# EAGLE design Midio (EAGLE 9.6.2)
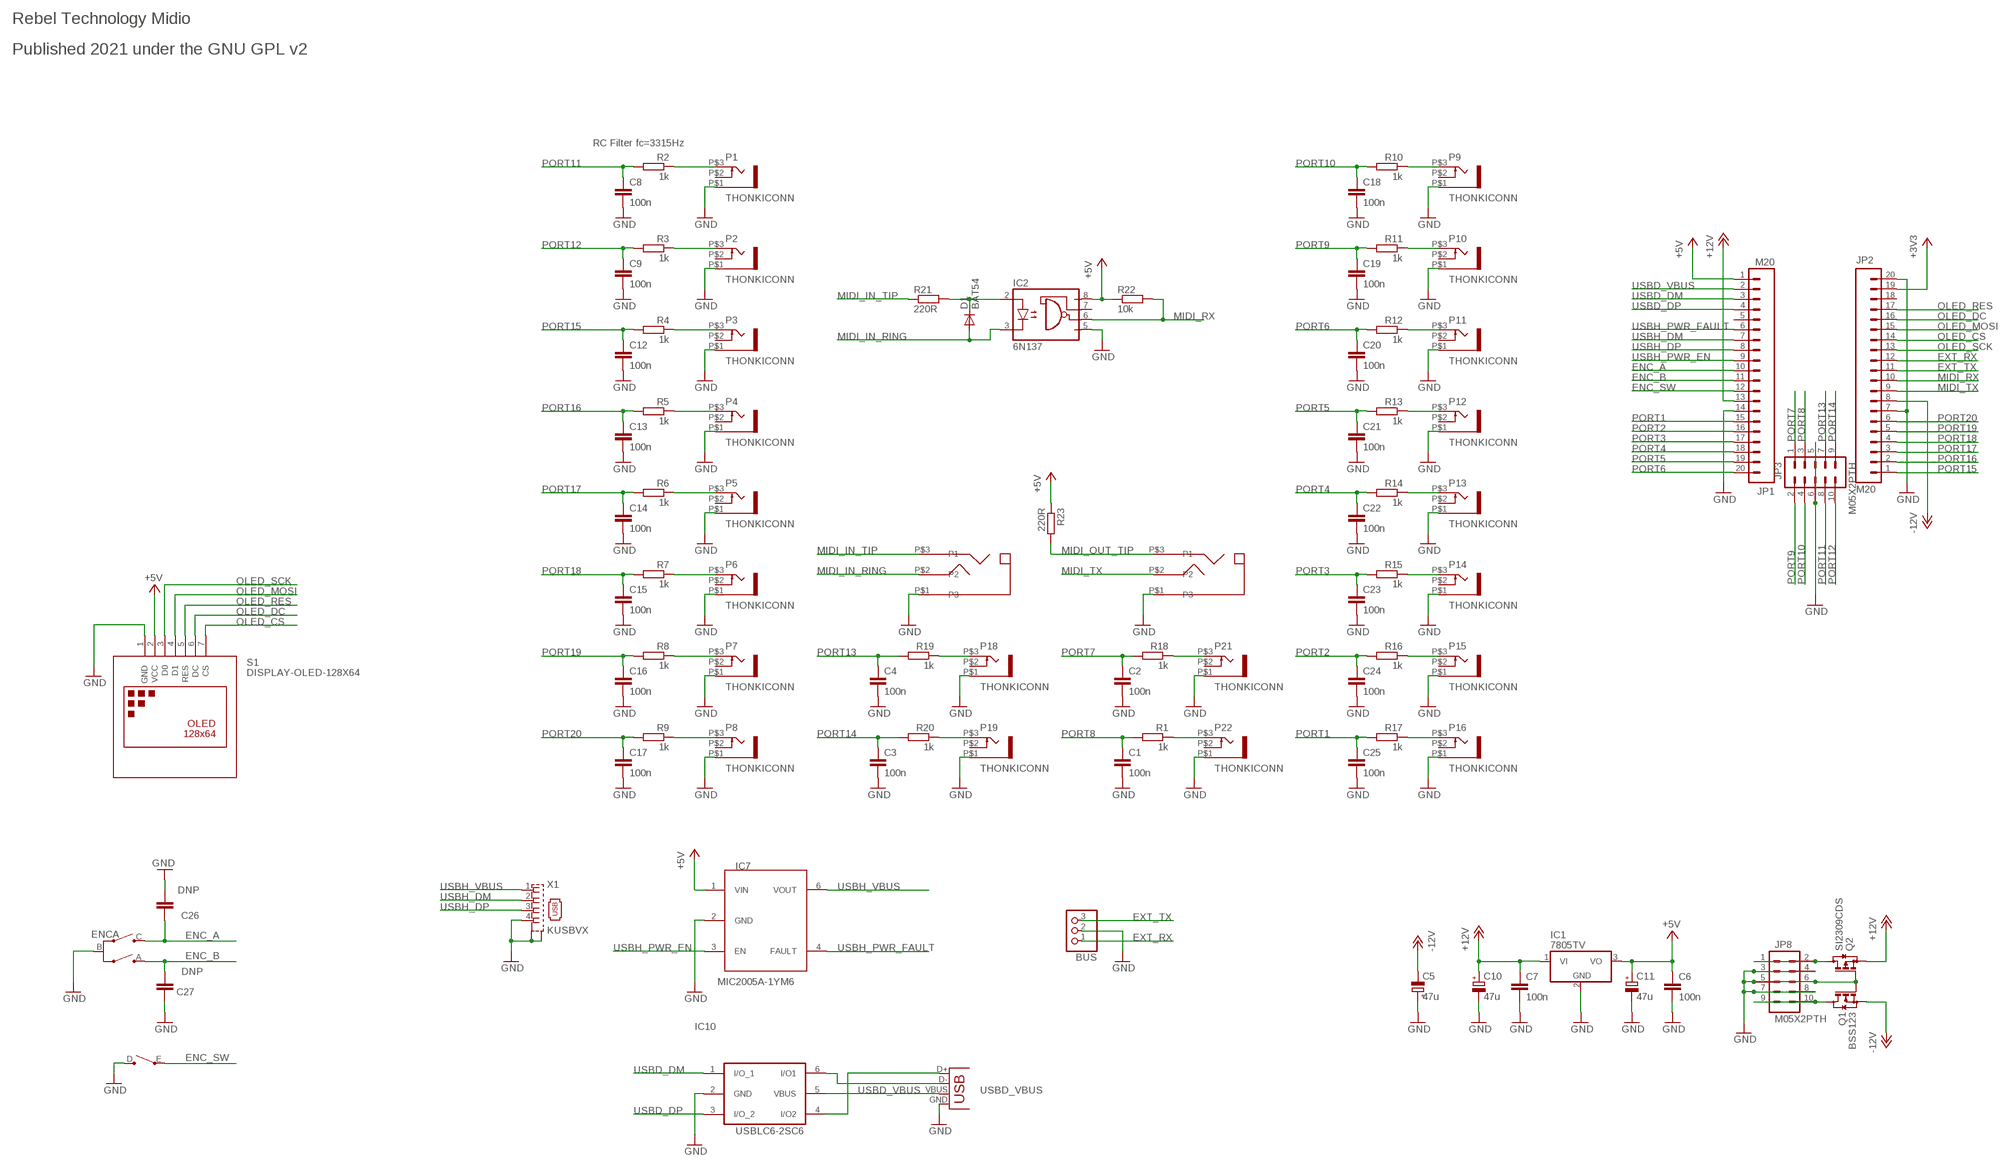
[diagram p0: schematic, sheet 1]

## Parts
BUS  CON-JST-1X03PH-TH  [JST-B3B-PH-KL]
C1  100n  C-EUC0603  [C0603]
C2  100n  C-EUC0603  [C0603]
C3  100n  C-EUC0603  [C0603]
C4  100n  C-EUC0603  [C0603]
C5  47u  CPOL-EUUD-4X5,8  [UD-4X5,8_NICHICON]
C6  100n  C-EUC0603  [C0603]
C7  100n  C-EUC0603  [C0603]
C8  100n  C-EUC0603  [C0603]
C9  100n  C-EUC0603  [C0603]
C10  47u  CPOL-EUUD-4X5,8  [UD-4X5,8_NICHICON]
C11  47u  CPOL-EUUD-4X5,8  [UD-4X5,8_NICHICON]
C12  100n  C-EUC0603  [C0603]
C13  100n  C-EUC0603  [C0603]
C14  100n  C-EUC0603  [C0603]
C15  100n  C-EUC0603  [C0603]
C16  100n  C-EUC0603  [C0603]
C17  100n  C-EUC0603  [C0603]
C18  100n  C-EUC0603  [C0603]
C19  100n  C-EUC0603  [C0603]
C20  100n  C-EUC0603  [C0603]
C21  100n  C-EUC0603  [C0603]
C22  100n  C-EUC0603  [C0603]
C23  100n  C-EUC0603  [C0603]
C24  100n  C-EUC0603  [C0603]
C25  100n  C-EUC0603  [C0603]
C26  DNP  C-EUC0603  [C0603]
C27  DNP  C-EUC0603  [C0603]
D1  BAT54  DIODESOT23_REFLOW  [SOT23-R]
ENC  CI-11  [CI-11]
IC1  7805TV  [TO220V]
IC2  6N137  [DIL08]
IC7  MIC2005A-1YM6  MIC2005  [SOT23-6]
IC10  USBLC6-2SC6  [SOT-23-6L]
J1  THONKICONN_STEREO  [THONKICONN_STEREO]
J2  THONKICONN_STEREO  [THONKICONN_STEREO]
JP1  M20  [1X20]
JP2  M20  [1X20]
JP3  M05X2PTH  [AVR_ICSP]
JP8  M05X2PTH  [AVR_ICSP]
P1  THONKICONN  [THONKICONN]
P2  THONKICONN  [THONKICONN]
P3  THONKICONN  [THONKICONN]
P4  THONKICONN  [THONKICONN]
P5  THONKICONN  [THONKICONN]
P6  THONKICONN  [THONKICONN]
P7  THONKICONN  [THONKICONN]
P8  THONKICONN  [THONKICONN]
P9  THONKICONN  [THONKICONN]
P10  THONKICONN  [THONKICONN]
P11  THONKICONN  [THONKICONN]
P12  THONKICONN  [THONKICONN]
P13  THONKICONN  [THONKICONN]
P14  THONKICONN  [THONKICONN]
P15  THONKICONN  [THONKICONN]
P16  THONKICONN  [THONKICONN]
P18  THONKICONN  [THONKICONN]
P19  THONKICONN  [THONKICONN]
P21  THONKICONN  [THONKICONN]
P22  THONKICONN  [THONKICONN]
Q1  BSS123  [SOT23]
Q2  SI2309CDS  BSS84  [SOT23]
R1  1k  R-EU_0603  [0603]
R2  1k  R-EU_0603  [0603]
R3  1k  R-EU_0603  [0603]
R4  1k  R-EU_0603  [0603]
R5  1k  R-EU_0603  [0603]
R6  1k  R-EU_0603  [0603]
R7  1k  R-EU_0603  [0603]
R8  1k  R-EU_0603  [0603]
R9  1k  R-EU_0603  [0603]
R10  1k  R-EU_0603  [0603]
R11  1k  R-EU_0603  [0603]
R12  1k  R-EU_0603  [0603]
R13  1k  R-EU_0603  [0603]
R14  1k  R-EU_0603  [0603]
R15  1k  R-EU_0603  [0603]
R16  1k  R-EU_0603  [0603]
R17  1k  R-EU_0603  [0603]
R18  1k  R-EU_0603  [0603]
R19  1k  R-EU_0603  [0603]
R20  1k  R-EU_0603  [0603]
R21  220R  R-EU_0603  [0603]
R22  10k  R-EU_0603  [0603]
R23  220R  R-EU_0603  [0603]
S1  DISPLAY-OLED-128X64  [DISPLAY-OLED-128X64]
X1  KUSBVX  [KUSBVX]
X2  USBPTH-VERTICAL  [USB-B-PTH-VERTICAL]

## Nets
+3V3: JP2.19
+5V: C6.1 C11.+ IC1.3(VO) IC2.8(VCC) IC7.1(VIN) JP1.1 R22.1 R23.1 S1.2(VCC)
+12V: C7.1 C10.+ IC1.1(VI) JP1.13 Q2.2(S)
-12V: C5.- JP2.8 Q1.2(S)
ENC_A: C26.1 ENC.C(A:B) JP1.10
ENC_B: C27.1 ENC.A(A:A) JP1.11
ENC_SW: ENC.E(B:E) JP1.12
EXT_RX: BUS.1 JP2.12
EXT_TX: BUS.3 JP2.11
GND: BUS.2 C1.2 C2.2 C3.2 C4.2 C5.+ C6.2 C7.2 C8.2 C9.2 C10.- C11.- C12.2 C13.2 C14.2 C15.2 C16.2 C17.2 C18.2 C19.2 C20.2 C21.2 C22.2 C23.2 C24.2 C25.2 C26.2 C27.2 ENC.B(A:C) ENC.D(B:D) IC1.2(GND) IC2.5(GND) IC7.2(GND) IC10.2(GND) J1.P$1(P3) J2.P$1(P3) JP1.14 JP2.7 JP2.20 JP3.5 JP3.6 JP8.3 JP8.4 JP8.5 JP8.6 JP8.7 JP8.8 P1.P$1 P2.P$1 P3.P$1 P4.P$1 P5.P$1 P6.P$1 P7.P$1 P8.P$1 P9.P$1 P10.P$1 P11.P$1 P12.P$1 P13.P$1 P14.P$1 P15.P$1 P16.P$1 P18.P$1 P19.P$1 P21.P$1 P22.P$1 Q1.1(G) Q2.1(G) S1.1(GND) X1.4 X1.M1(S1) X1.M2(S2) X2.GND
MIDI_IN_RING: D1.1(A) IC2.3(C) J1.P$2(P2)
MIDI_IN_TIP: J1.P$3(P1) R21.1
MIDI_OUT_TIP: J2.P$3(P1) R23.2
MIDI_RX: IC2.6(VO) JP2.10 R22.2
MIDI_TX: J2.P$2(P2) JP2.9
N$1: P8.P$3 R9.1
N$2: P7.P$3 R8.1
N$3: P6.P$3 R7.1
N$4: P5.P$3 R6.1
N$5: P4.P$3 R5.1
N$6: P3.P$3 R4.1
N$7: P2.P$3 R3.1
N$8: P1.P$3 R2.1
N$9: P16.P$3 R17.1
N$10: P15.P$3 R16.1
N$11: P14.P$3 R15.1
N$12: P13.P$3 R14.1
N$13: P12.P$3 R13.1
N$14: P9.P$3 R10.1
N$15: P10.P$3 R11.1
N$16: P11.P$3 R12.1
N$17: P22.P$3 R1.1
N$18: P21.P$3 R18.1
N$19: P18.P$3 R19.1
N$20: P19.P$3 R20.1
N$21: D1.3(C) IC2.2(A) R21.2
N$22: IC10.6(I/O1) X2.D-
N$23: IC10.4(I/O2) X2.D+
N$24: JP8.9 JP8.10 Q1.3(D)
N$25: JP8.1 JP8.2 Q2.3(D)
OLED_CS: JP2.14 S1.7(CS)
OLED_DC: JP2.16 S1.6(DC)
OLED_MOSI: JP2.15 S1.4(D1)
OLED_RES: JP2.17 S1.5(RES)
OLED_SCK: JP2.13 S1.3(D0)
PORT1: C25.1 JP1.15 R17.2
PORT2: C24.1 JP1.16 R16.2
PORT3: C23.1 JP1.17 R15.2
PORT4: C22.1 JP1.18 R14.2
PORT5: C21.1 JP1.19 R13.2
PORT6: C20.1 JP1.20 R12.2
PORT7: C2.1 JP3.1 R18.2
PORT8: C1.1 JP3.3 R1.2
PORT9: C19.1 JP3.2 R11.2
PORT10: C18.1 JP3.4 R10.2
PORT11: C8.1 JP3.8 R2.2
PORT12: C9.1 JP3.10 R3.2
PORT13: C4.1 JP3.7 R19.2
PORT14: C3.1 JP3.9 R20.2
PORT15: C12.1 JP2.1 R4.2
PORT16: C13.1 JP2.2 R5.2
PORT17: C14.1 JP2.3 R6.2
PORT18: C15.1 JP2.4 R7.2
PORT19: C16.1 JP2.5 R8.2
PORT20: C17.1 JP2.6 R9.2
USBD_DM: IC10.1(I/O_1) JP1.3
USBD_DP: IC10.3(I/O_2) JP1.4
USBD_VBUS: IC10.5(VBUS) JP1.2 X2.VBUS
USBH_DM: JP1.7 X1.2
USBH_DP: JP1.8 X1.3
USBH_PWR_EN: IC7.3(EN) JP1.9
USBH_PWR_FAULT: IC7.4(FAULT) JP1.6
USBH_VBUS: IC7.6(VOUT) X1.1
Unconnected: IC2.7(VE) JP1.5 JP2.18 P1.P$2 P2.P$2 P3.P$2 P4.P$2 P5.P$2 P6.P$2 P7.P$2 P8.P$2 P9.P$2 P10.P$2 P11.P$2 P12.P$2 P13.P$2 P14.P$2 P15.P$2 P16.P$2 P18.P$2 P19.P$2 P21.P$2 P22.P$2

## Notes on the sheet
- Rebel Technology Midio
- Published 2021 under the GNU GPL v2
- RC Filter fc=3315Hz

## Library data of the parts
BUS = Rebel:CON-JST-1X03
C1-C4 C6-C9 C12-C25 = Rebel:C-EU: CAPACITOR, European symbol
C5 C10 = Rebel:CPOL-EU: POLARIZED CAPACITOR, European symbol
C11 = rcl:CPOL-EU: POLARIZED CAPACITOR, European symbol
C26 C27 = rcl:C-EU: CAPACITOR, European symbol
D1 = adafruit:DIODE: Diode SMADIODE - SMA Surface Mount Package 20V 1A Schottky Diode Digikey: 641-1014-6-ND DO-1N4148 - Through Hole Small Current Diode SOD-123 20V 1 A (.5mV Vf) Schottky Diode - Digikey: MBRX120TPMSCT-ND SOD-323 10V 570mA (.38mV Vf, 3ns) Schottky Diode - Digikey: ZLLS410CT-ND SOD-523 30V 30mA Schottky Diode (RB751S-40TE61) - Digikey: RB751S-40TE61CT-ND SOT23-R/W - SOT23 Package (R = Solder Paste/Reflow Ovens, W = Hand-Soldering) BAT54Film 40V 300mA - Digikey: 497-7162-1-ND
ENC = piher:CI-11: 11mm Incemental Encoder Source: www.piher.net .. 04-CI-11v04.pdf
IC1 = linear:78*: Positive VOLTAGE REGULATOR Source: http://cache.national.com/ds/LM/LM78L05.pdf http://www.fairchildsemi.com/ds/LM/LM7805.pdf
IC2 = optocoupler:6N137: MOTOROLA OPTO COUPLER; MPN: 6N137; OC_FARNELL: 1328376; OC_NEWARK: 52M1895
IC7 = James:MIC2005; OC_FARNELL: 2509882
IC10 = usblc6:USBLC6-2: VERY LOW CAPACITANCE ESD PROTECTION 2 line Datasheet link <http://www.st.com/web/catalog/sense_power/FM114/CL1137/SC1489/PF93353>
J1 J2 = Rebel:THONKICONN_STEREO
JP1 JP2 = SparkFun:M20: This is just like the LOCK variant in that the holes are staggared by 5 mil, but except for the last two holes. They are not altered from the "standard" footprint layout. This is used for a special purpose on the layout of our Graphic LCD Backpack. Make sure you want to use this device before selecting it for you project!
JP3 JP8 = SparkFun:M05X2: Header 5x2 Standard 10-pin dual row 0.1" header. Commonly used with AVR-ISP. Use with Spark Fun Electronics SKU: PRT-00778
P1-P16 P18 P19 P21 P22 = Rebel:THONKICONN
Q1 = transistor-small-signal:BSS123: N-CHANNEL MOS FET; OC_FARNELL: 1843725
Q2 = transistor-small-signal:BSS84: P-CHANNEL MOS FET; OC_FARNELL: 1779264
R1-R23 = Rebel:R-EU_: RESISTOR, European symbol
S1 = diy-modules:DISPLAY-OLED-128X64: 128x64 Dot Matrix OLED Module based on SSD1306 chip Variant with SPI interface More details available here: http://www.instructables.com/id/How-to-use-OLED-display-arduino-module/ SSD1306 datasheet: https://cdn-shop.adafruit.com/datasheets/SSD1306.pdf Click here to find device on ebay.com <http://www.ebay.com/sch/oled+display+128x64> Note: There are two variants: I2C and SPI. Search for the proper version.
X1 = con-kycon:KUSBVX: Vertical,Top Entry Universal Serial Bus Connector KUSBVX Series Source: KYCON Sibalco USB vertical socket KUSBV.pdf
X2 = SparkFun:USB: USB Connectors USB-B-PTH is fully proven SKU : PRT-00139 USB-miniB is fully proven SKU : PRT-00587 USB-A-PCB is untested. USB-A-H is throughly reviewed, but untested. Spark Fun Electronics SKU : PRT-00437 USB-B-SMT is throughly reviewed, but untested. Needs silkscreen touching up. USB-A-S has not been used/tested USB-MB-H has not been used/tested

## Net classes
1 power: width 0.178 mm, drill 0.305 mm, clearance 0.178 mm to class 0, clearance 0.178 mm

## Board
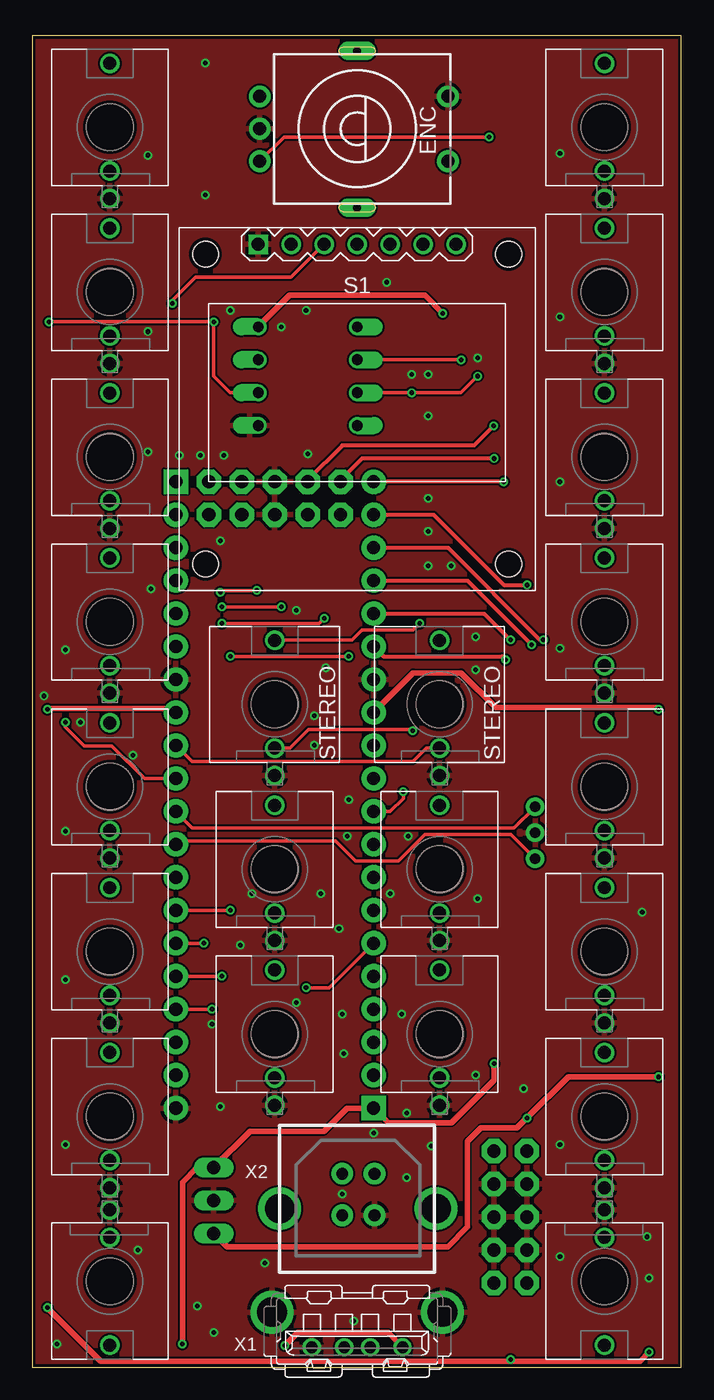
[diagram p1: board, top side]
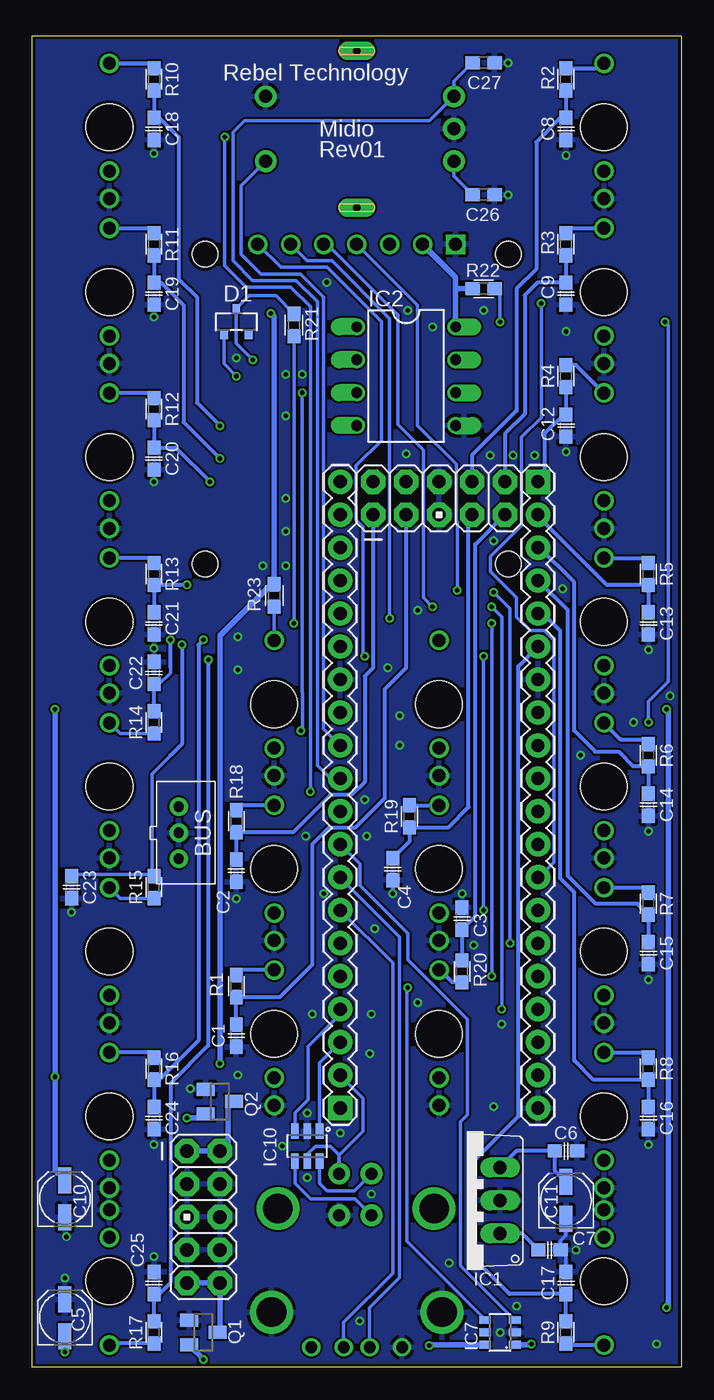
[diagram p2: board, bottom side, seen from below]

Size 50 x 102.54 mm. Coordinates in mm from the lower left corner, seen from the top.
Outline: 0,0 50,0 50,102.54 0,102.54 0,0
Copper layers (1*16): Top 0.035mm / dielectric 1.5mm / Bottom 0.035mm
Design rules "SeeedStudio_2layer_DRU_no_angle_20140221": minimum track width 6mil, minimum drill 12mil, track to track 6mil, track to pad 6mil, pad to pad 6mil, via to via 6mil, smd to smd 0mil, copper to edge 10mil, drill to drill 10mil, minimum pad ring 10mil, minimum via ring 6mil, stop-mask expansion 2mil, vias tented up to drill 100mil, thermal gap 10mil

### Footprints (pad centres in the part's own frame; a part is rotated, then mirrored left to right if it is on the bottom)
JST-B3B-PH-KL = drill 0.8 pad 1.422: 1 2,0; 2 0,0; 3 -2,0
C0603 = smd 1.1 x 1: 1 -0.85,0; 2 0.85,0
UD-4X5,8_NICHICON = smd 2 x 1: + 1.425,0; - -1.425,0
SOT23-R = smd 0.6 x 0.7: 1 -0.95,-1; 2 0.95,-1; 3 0,1
CI-11 = drill 1 pad 1.676: A -2.5,-7.5; B 0,-7.5; C 2.5,-7.5; D -2.5,7; E 2.5,7 | drill 0.6 pad 1.422 long: C1 -6,0; C2 6.065,0
TO220V = drill 1.016 long: 1 -2.54,-2.54; 2 0,-2.54; 3 2.54,-2.54
DIL08 = drill 0.813 offset: 1 -3.81,-3.81; 2 -1.27,-3.81; 3 1.27,-3.81; 4 3.81,-3.81; 5 3.81,3.81; 6 1.27,3.81; 7 -1.27,3.81; 8 -3.81,3.81
SOT23-6 = smd 0.6 x 0.9: 1 -0.95,-1.15; 2 0,-1.15; 3 0.95,-1.15; 4 0.95,1.15; 5 0,1.15; 6 -0.95,1.15
SOT-23-6L = smd 0.6 x 1.2: 1 -0.95,-1.15; 2 0,-1.15; 3 0.95,-1.15; 4 0.95,1.15; 5 0,1.15; 6 -0.95,1.15
THONKICONN_STEREO = drill 1: P$1 0,-5.5; P$2 0,-3.38; P$3 0,4.92 | hole 3.6: 0,0
1X20 = drill 1.016 pad 1.88 square: 1 0,0 | drill 1.016 pad 1.88: 2 2.54,0; 3 5.08,0; 4 7.62,0; 5 10.16,0; 6 12.7,0; 7 15.24,0; 8 17.78,0; 9 20.32,0; 10 22.86,0; 11 25.4,0; 12 27.94,0; 13 30.48,0; 14 33.02,0; 15 35.56,0; 16 38.1,0; 17 40.64,0; 18 43.18,0; 19 45.72,0; 20 48.26,0
AVR_ICSP = drill 1.016 pad 1.88 octagon: 1 -1.27,5.08; 2 1.27,5.08; 3 -1.27,2.54; 4 1.27,2.54; 5 -1.27,0; 6 1.27,0; 7 -1.27,-2.54; 8 1.27,-2.54; 9 -1.27,-5.08; 10 1.27,-5.08
THONKICONN = drill 1: P$1 0,-5.5; P$2 0,-3.38; P$3 0,4.92 | hole 3.6: 0,0
SOT23 = smd 1 x 1.4: 1 -0.95,-1.1; 2 0.95,-1.1; 3 0,1.1
0603 = smd 1.1 x 1: 1 -0.85,0; 2 0.85,0
DISPLAY-OLED-128X64 = drill 1 square: 1 -7.62,12.7 | drill 1: 2 -5.08,12.7; 3 -2.54,12.7; 4 0,12.7; 5 2.54,12.7; 6 5.08,12.7; 7 7.62,12.7 | hole 2: -11.684,11.938; 11.684,11.938; 11.684,-11.938; -11.684,-11.938
KUSBVX = drill 0.9 pad 1.3: 1 3.5,0; 2 1,0; 3 -1,0; 4 -3.5,0 | drill 2.3 pad 2.8: M1 -6.57,2.71; M2 6.57,2.71
USB-B-PTH-VERTICAL = drill 0.914 pad 1.676: D+ -1.143,-1.257; D- -1.143,1.943; GND 1.346,-1.257; VBUS 1.346,1.943 | drill 2.286: P$1 -5.969,-0.749; P$2 6.071,-0.749

### Placement (x,y rotation side)
BUS  38.73,41.15 270 bottom
C1  34.29,25.53 270 bottom
C2  34.29,38.23 270 bottom
C3  16.89,34.54 90 bottom
C4  22.23,38.35 270 bottom
C5  47.5,3.81 90 bottom
C6  8.89,16.64 0 bottom
C7  10.16,9.02 0 bottom
C8  8.89,95.38 270 bottom
C9  8.89,82.68 270 bottom
C10  47.5,12.95 90 bottom
C11  8.89,12.83 90 bottom
C12  8.89,72.52 270 bottom
C13  2.54,57.28 270 bottom
C14  2.54,43.31 270 bottom
C15  2.54,31.88 270 bottom
C16  2.54,19.18 270 bottom
C17  8.89,6.48 90 bottom
C18  40.64,95.38 270 bottom
C19  40.64,82.68 270 bottom
C20  40.64,69.98 270 bottom
C21  40.64,57.28 270 bottom
C22  40.64,53.47 90 bottom
C23  46.99,36.96 270 bottom
C24  40.64,19.18 270 bottom
C25  40.64,6.48 90 bottom
C26  15.24,90.3 0 bottom
C27  15.24,100.46 0 bottom
D1  34.29,80.52 0 bottom
ENC  25.02,95.38 270 top
IC1  16.51,12.83 90 bottom
IC2  21.21,76.33 270 bottom
IC7  13.97,2.67 90 bottom
IC10  28.83,17.02 180 bottom
J1  18.67,51.05 0 top
J2  31.37,51.05 0 top
JP1  26.29,19.94 90 bottom
JP2  11.05,68.2 270 bottom
JP3  18.67,66.93 90 bottom
JP8  36.83,11.56 0 bottom
P1  5.97,95.5 0 top
P2  5.97,82.8 0 top
P3  5.97,70.1 0 top
P4  5.97,57.4 0 top
P5  5.97,44.7 0 top
P6  5.97,32 0 top
P7  5.97,19.3 0 top
P8  5.97,6.6 180 top
P9  44.07,95.5 0 top
P10  44.07,82.8 0 top
P11  44.07,70.1 0 top
P12  44.07,57.4 0 top
P13  44.07,44.7 0 top
P14  44.07,32 0 top
P15  44.07,19.3 0 top
P16  44.07,6.6 180 top
P18  18.67,38.35 0 top
P19  18.67,25.65 0 top
P21  31.37,38.35 0 top
P22  31.37,25.65 0 top
Q1  36.83,2.67 270 bottom
Q2  35.56,20.45 270 bottom
R1  34.29,29.34 270 bottom
R2  8.89,99.19 270 bottom
R3  8.89,86.49 270 bottom
R4  8.89,76.33 270 bottom
R5  2.54,61.09 270 bottom
R6  2.54,47.12 270 bottom
R7  2.54,35.69 270 bottom
R8  2.54,22.99 270 bottom
R9  8.89,2.67 90 bottom
R10  40.64,99.19 270 bottom
R11  40.64,86.49 270 bottom
R12  40.64,73.79 270 bottom
R13  40.64,61.09 270 bottom
R14  40.64,49.66 90 bottom
R15  40.64,36.96 90 bottom
R16  40.64,22.99 270 bottom
R17  40.64,2.67 90 bottom
R18  34.29,42.04 270 bottom
R19  20.95,42.42 270 bottom
R20  16.89,30.48 90 bottom
R21  29.84,80.26 90 bottom
R22  15.24,83.06 0 bottom
R23  31.37,59.44 270 bottom
S1  25.02,73.79 0 top
X1  25.02,1.52 0 top
X2  25.02,12.95 0 top

### Tracks (layer width: path | path; a pad name or v marks a point on that pad's centre or on a via)
+5V  (via drill 0.35)
  Top 0.406: v35.56,23.37 35.56,22.1 32.27,18.81 27.42,18.81 JP1.1 24.26,19.94 22.48,18.16 16.76,18.16 IC1.3 12.7,15.37 11.56,14.22 v11.56,1.78 | v31.62,81.15 30.23,82.55 19.81,82.55 IC2.8
  Bottom 0.305: IC1.3 12.7,16.64 C6.1 9.74,15.1 C11.+
  Bottom 0.406: v35.56,23.37 35.56,56.35 31.62,60.29 R23.1 31.37,80.9 v31.62,81.15 | S1.2 17.4,83.95 17.4,83.06 | 17.4,83.06 IC2.8 | R22.1 17.4,83.06 | IC7.1 11.62,1.72 v11.56,1.78
+12V  (via drill 0.35)
  Top 0.406: JP1.13 29.34,53.47 33.02,53.47 35.69,50.79 48.14,50.79 v48.26,50.67 | IC1.1 14.99,9.27 32,9.27 33.53,10.79 33.53,17.4 34.54,18.41 37.34,18.41 v38.1,19.18 41.27,22.35 v48.26,22.35
  Bottom 0.305: C7.1 12.28,10.29 IC1.1
  Bottom 0.406: v48.26,50.67 v48.26,22.35 48.26,15.14 C10.+ | Q2.2 36.98,19.18 v38.1,19.18
-12V  (via drill 0.35)
  Top 0.406: JP2.8 11.05,50.43 10.75,50.73 1.2,50.73 v1.14,50.67 | v1.14,4.57 5.25,0.46 36.83,0.46 | 36.83,0.46 46.82,0.46 v47.5,1.14 | v36.83,0.58 36.83,0.46
  Bottom 0.254: Q1.2 38.1,1.55
  Bottom 0.406: v1.14,50.67 1.02,50.55 1.02,4.7 v1.14,4.57 | v47.5,1.14 C5.- | 38.1,1.55 37.8,1.55 v36.83,0.58
ENC_A  (via drill 0.35)
  Top 0.254: JP1.10 27.56,42.8 28.57,43.82 v28.57,44.32 | v35.18,94.74 19.38,94.74 ENC.C
  Bottom 0.254: ENC.C 17.52,91.73 C26.1 | v28.57,44.32 28.57,81.66 30.1,83.19 33.53,83.19 35.18,84.84 v35.18,94.74
ENC_B
  Bottom 0.254: JP1.11 27.05,45.34 28.05,46.33 28.05,82.06 29.67,83.69 33.02,83.69 34.54,85.22 34.54,95.12 33.67,96 19.4,96 ENC.A 17.52,99.03 C27.1
ENC_SW
  Bottom 0.254: JP1.12 27.56,49.15 27.56,82.42 29.34,84.2 32.38,84.2 33.91,85.72 33.91,90.99 ENC.E
EXT_RX
  Top 0.254: JP2.12 11.05,40.3 11.29,40.54 23.35,40.54 24.89,38.99 28.19,38.99 30.23,41.02 33.02,41.02 34.42,41.02 36.86,41.02 BUS.1
EXT_TX
  Top 0.254: JP2.11 12.32,41.53 37.12,41.53 BUS.3
GND  (via drill 0.35)
  Bottom 0.254: C4.2 v22.23,36.45 | C17.2 8.89,8.6 C7.2 9.31,9.71 8.89,10.13 C11.-
  other vias: 23.88,27.18 14.48,20.07 21.72,47.88 7.75,47.12 3.68,49.66 24,24.13 23.62,33.78 13.84,26.42 24.26,40.89 17.91,8 24.77,3.56 21.72,50.16 22.61,53.85 30.48,61.72 30.48,64.39 32.26,61.72 30.48,66.93 30.48,73.28 30.48,76.45 29.21,76.45 21.21,70.36 27.3,83.57 19.18,80.14 14.48,63.63 9.14,59.94 2.54,55.25 2.54,41.28 2.54,29.84 2.54,17.14 40.64,17.14 40.64,8.51 47.5,6.86 47.37,10.03 8.13,9.02 13.97,2.67 16.89,36.45 34.16,22.48 37.85,21.46 46.99,35.05 40.64,55.37 40.64,68.2 40.64,80.9 40.64,93.47 13.34,100.46 13.34,90.3 11.3,70.23 8.89,70.48 8.89,79.76 8.89,93.34 34.29,77.72 20.32,28.07 16,32.51 14.73,70.23 12.95,70.23 15.24,81.41 12.7,4.7 28.83,19.56 28.45,27.18 27.56,36.45 28.96,40.89 34.29,36.07 24.38,43.69 34.16,53.72 34.16,56.26 21.08,81.41 20.32,58.29 30.73,17.02 26.29,18.03 23.88,13.34 28.83,14.61 1.91,1.78 0.89,51.69
  pour Bottom: -2.67,103 51.94,103 52.07,-1.14 -2.67,-1.14
  pour Top: -1.4,103 51.94,103 52.07,-1.14 51.94,-1.14 -1.4,-1.14
MIDI_IN_RING  (via drill 0.35)
  Top 0.254: J1.P$2 19.86,47.67 21.29,49.1 29.23,49.1 v29.31,49.02 | IC2.3 v29.21,75.06 33.02,75.06 v34.29,76.33
  Bottom 0.254: v29.31,49.02 29.19,49.14 29.19,51.96 29.21,51.98 v29.21,75.06 | v34.29,76.33 35.24,77.28 D1.1
MIDI_IN_TIP  (via drill 0.35)
  Top 0.254: J1.P$3 18.7,56.01 24.64,56.01 25.4,56.77 29.34,56.77 v29.84,57.28
  Bottom 0.254: v29.84,57.28 R21.1
MIDI_OUT_TIP
  Bottom 0.254: J2.P$3 R23.2
MIDI_RX  (via drill 0.35)
  Top 0.254: JP2.10 8.64,45.34 6.12,47.85 3.99,47.85 2.54,49.31 v2.54,49.66 | v1.27,80.52 v13.97,80.52 13.97,76.33 15.24,75.06 IC2.6
  Bottom 0.254: v2.54,49.66 2.54,51.28 1.02,52.8 1.02,80.26 v1.27,80.52 | R22.2 13.97,82.64 v13.97,80.52
MIDI_TX
  Top 0.254: J2.P$2 30.35,47.67 29.32,46.64 12.29,46.64 JP2.9
N$1
  Bottom 0.305: P8.P$3 8.76,1.68 R9.1
N$2
  Bottom 0.305: P7.P$3 2.93,24.22 R8.1
N$3
  Bottom 0.305: P6.P$3 2.93,36.92 R7.1
N$4
  Bottom 0.305: P5.P$3 4.7,48.35 2.93,48.35 R6.1
N$5
  Bottom 0.305: P4.P$3 2.93,62.32 R5.1
N$6
  Bottom 0.305: P3.P$3 8.12,77.18 R4.1
N$7
  Bottom 0.305: R3.1 8.5,87.72 P2.P$3
N$8
  Bottom 0.305: R2.1 6.36,100.04 P1.P$3
N$9
  Bottom 0.305: R17.1 43.94,1.82 P16.P$3
N$10
  Bottom 0.305: R16.1 41.03,24.22 P15.P$3
N$11
  Bottom 0.254: R15.1 43.25,36.11 P14.P$3
N$12
  Bottom 0.254: R14.1 43.25,48.81 P13.P$3
N$13
  Bottom 0.305: R13.1 41.03,62.32 P12.P$3
N$14
  Bottom 0.305: P9.P$3 41.03,100.42 R10.1
N$15
  Bottom 0.305: P10.P$3 41.03,87.72 R11.1
N$16
  Bottom 0.305: R12.1 41.03,75.02 P11.P$3
N$17
  Bottom 0.305: P22.P$3 33.9,30.57 R1.1
N$18
  Bottom 0.305: P21.P$3 33.9,43.27 R18.1
N$19
  Bottom 0.254: P18.P$3
  Bottom 0.305: R19.1 P18.P$3
N$20
  Bottom 0.305: R20.1 17.65,29.63 18.6,30.57 P19.P$3
N$21  (via drill 0.35)
  Top 0.254: v33.02,77.6 IC2.2
  Bottom 0.254: R21.2 31.24,82.51 33.3,82.51 D1.3 34.29,78.87 v33.02,77.6
N$22
  Bottom 0.254: IC10.6 27.88,14.16 27.3,13.59 25.18,13.59 X2.D-
N$23
  Bottom 0.254: IC10.4 29.78,14.16 28.57,12.95 25.13,12.95 X2.D+
N$24
  Bottom 0.406: Q1.3 35.56,2.84 JP8.10 JP8.9
N$25
  Bottom 0.406: JP8.1 JP8.2 34.92,17.27 34.92,19.98 Q2.3
OLED_CS  (via drill 0.35)
  Top 0.254: v15.24,54.74 v24.38,54.74 | JP2.14 v15.24,35.18
  Bottom 0.254: v15.24,54.74 v15.24,35.18 | v24.38,54.74 24.51,54.86 24.51,64.7 25.07,65.26 25.07,69.42 23.11,71.37 23.11,80.52 27.3,84.71 30.86,84.71 S1.7
OLED_DC  (via drill 0.35)
  Top 0.254: v22.48,57.66 22.1,57.28 v14.61,57.28 | JP2.16 v14.61,30.1
  Bottom 0.254: v14.61,30.1 v14.61,57.28 | S1.6 28.83,85.22 26.92,85.22 22.48,80.77 v22.48,57.66
OLED_MOSI  (via drill 0.35)
  Top 0.254: JP2.15 v13.21,32.64 | v17.27,59.82 14.61,59.82 v14.48,59.69
  Bottom 0.254: v13.21,32.64 13.21,58.42 v14.48,59.69 | S1.4 20.32,81.79 20.32,72.52 17.35,69.55 17.35,65.15 17.27,65.08 v17.27,59.82
OLED_RES  (via drill 0.35)
  Top 0.254: v14.61,58.55 v19.18,58.55 | JP2.17 v13.84,27.56
  Bottom 0.254: v13.84,27.56 13.84,57.79 v14.61,58.55 | v19.18,58.55 19.89,59.26 19.89,70.62 21.84,72.58 21.84,81.03 27.3,86.49 S1.5
OLED_SCK  (via drill 0.35)
  Top 0.254: v10.79,81.91 10.79,82.17 12.57,83.95 19.94,83.95 S1.3
  Bottom 0.254: JP2.13 10.98,37.72 9.83,38.87 9.83,56 10.54,56.72 11.63,56.72 12.7,57.79 12.7,59.26 14.72,61.28 14.72,62.42 12.32,64.82 12.32,71.63 10.79,73.15 v10.79,81.91
PORT1  (via drill 0.35)
  Top 0.305: JP1.15 27.05,54.74 36.2,54.74 v36.45,54.48
  Bottom 0.305: R17.2 40.64,5.21 | 40.64,5.21 C25.1 | v36.45,54.48 36.45,24.77 39.37,21.84 39.37,6.48 40.64,5.21
PORT2  (via drill 0.35)
  Top 0.305: JP1.16 34.8,58.04 v36.83,56.01
  Bottom 0.305: R16.2 40.64,21.72 | 40.64,21.72 C24.1 | 40.64,21.72 37.21,25.15 37.21,55.63 v36.83,56.01
PORT3  (via drill 0.35)
  Top 0.305: JP1.17 33.53,60.58 v38.48,55.63
  Bottom 0.254: 40.79,37.96 46.84,37.96 C23.1 | R15.2 40.79,37.96 | 39.37,47.12 40.79,45.7 40.79,37.96
  Bottom 0.305: 39.37,47.12 38.48,48.01 v38.48,55.63
PORT4  (via drill 0.35)
  Top 0.305: JP1.18 32,63.12 39.12,56.01 v39.37,56.01
  Bottom 0.254: C22.1 40.22,52.62 39.37,53.47 39.37,53.89
  Bottom 0.305: R14.2 C22.1 | 39.37,53.89 v39.37,56.01
PORT5  (via drill 0.35)
  Top 0.305: JP1.19 30.9,65.66 36.33,60.24 v38.1,60.24
  Bottom 0.305: C21.1 R13.2 v38.1,60.24
PORT6  (via drill 0.35)
  Top 0.305: v36.32,68.2 JP1.20
  Bottom 0.305: R12.2 C20.1 38.95,70.83 v36.32,68.2
PORT7
  Bottom 0.305: C2.1 R18.2 29.93,41.19 27.05,44.07 25.4,44.07 24.38,45.09 24.38,53.21 23.75,53.85 JP3.1
PORT8
  Bottom 0.305: C1.1 R1.2 30.95,28.49 28.45,30.99 28.45,40.26 27.18,41.53 25.15,41.53 22.86,43.82 22.86,52.2 21.21,53.85 JP3.3
PORT9  (via drill 0.35)
  Top 0.305: v35.56,69.98 25.4,69.98 23.75,68.33 JP3.2
  Bottom 0.305: R11.2 C19.1 40.09,83.53 38.35,81.79 38.35,72.77 v35.56,69.98
PORT10  (via drill 0.35)
  Top 0.305: v35.55,72.51 34.04,70.99 23.88,70.99 21.21,68.33 JP3.4
  Bottom 0.305: R10.2 C18.1 40.22,96.23 38.73,94.73 38.73,83.81 37.33,82.41 37.33,74.29 v35.55,72.51
PORT11
  Bottom 0.305: R2.2 C8.1 9.31,96.23 11.18,94.36 11.18,84.58 12.7,83.06 12.7,73.66 16.13,70.23 JP3.8
PORT12
  Bottom 0.305: R3.2 C9.1 11.09,83.53 12.06,82.55 12.06,73.41 13.59,71.88 JP3.10
PORT13
  Bottom 0.305: JP3.7 16.39,65.4 16.39,43.14 17.96,41.57 R19.2 20.95,40.47 C4.1
PORT14
  Bottom 0.305: JP3.9 15.88,63.37 15.88,34.71 C3.1 R20.2
PORT15
  Bottom 0.305: R4.2 8.89,73.53 | 8.89,73.53 C12.1 | JP2.1 10.54,68.71 10.54,71.88 8.89,73.53
PORT16
  Bottom 0.305: C13.1 R5.2 5.75,60.24 11.05,65.53 JP2.2
PORT17
  Bottom 0.305: C14.1 R6.2 3.68,46.27 4.83,47.41 6.64,47.41 8.26,49.02 8.26,60.45 10.92,63.12 JP2.3
PORT18
  Bottom 0.305: C15.1 R7.2 3.39,35.69 6.6,35.69 8.76,37.85 8.76,58.29 JP2.4
PORT19
  Bottom 0.305: C16.1 R8.2 6.77,22.14 8.26,23.62 8.26,36.56 9.35,37.66 9.35,56.72 10.67,58.04 JP2.5
PORT20
  Bottom 0.305: R9.2 C17.1 13.25,5.63 16,8.38 16,15.88 12.57,19.3 12.57,53.98 JP2.6
USBD_DM
  Bottom 0.254: IC10.1 27.88,23.43 JP1.3
USBD_DP
  Bottom 0.254: IC10.3 29.78,19.56 28.76,20.58 28.76,24.7 26.29,27.18 JP1.4
USBD_VBUS
  Bottom 0.254: JP1.2 24.51,20.7 24.51,18.15 26.36,16.29 X2.VBUS 26.36,16.33 27.05,17.02 28.19,17.02 28.83,16.38 IC10.5
USBH_DM
  Bottom 0.254: X1.2 26.02,3.43 22.23,7.22 22.23,31.11 JP1.7
USBH_DP
  Bottom 0.254: X1.3 24.02,4.57 21.72,6.87 21.72,33.15 JP1.8
USBH_PWR_EN
  Bottom 0.254: JP1.9 24.77,38.73 24.77,37.08 21.08,33.4 21.08,31.37 16.49,26.77 16.49,19.42 17.02,18.89 17.02,7.81 IC7.3
USBH_PWR_FAULT  (via drill 0.35)
  Top 0.254: JP1.6 22.86,29.21 v21.08,29.21
  Bottom 0.254: v21.08,29.21 21.13,29.16 21.13,9.69 15.12,3.68 IC7.4
USBH_VBUS  (via drill 0.35)
  Top 0.406: v19.43,1.65 20.45,2.67 27.38,2.67 X1.1
  Bottom 0.254: 19.36,1.72 v19.43,1.65
  Bottom 0.406: IC7.6 19.36,1.72

### Text on the board
bPlace: Rebel Technology | Midio | Rev01